# Altium schematic sheet BMS.SchDoc
size A3; ApprovedBy: Arş.Gör.Dr Şaban ULUS; CheckedBy: Arş.Gör.Dr Şaban ULUS; Engineer: Nasıf Can PELTEK; DocumentNumber: 2; Revision: -; SheetNumber: 2; SheetTotal: 2; releaseDate: 12.03.2024; changeDate: -; Department: Faculuty Of Engineering; Size: A3; projeDescription: 1S BMS PROTOYPE; fileName: BMS.SchDoc
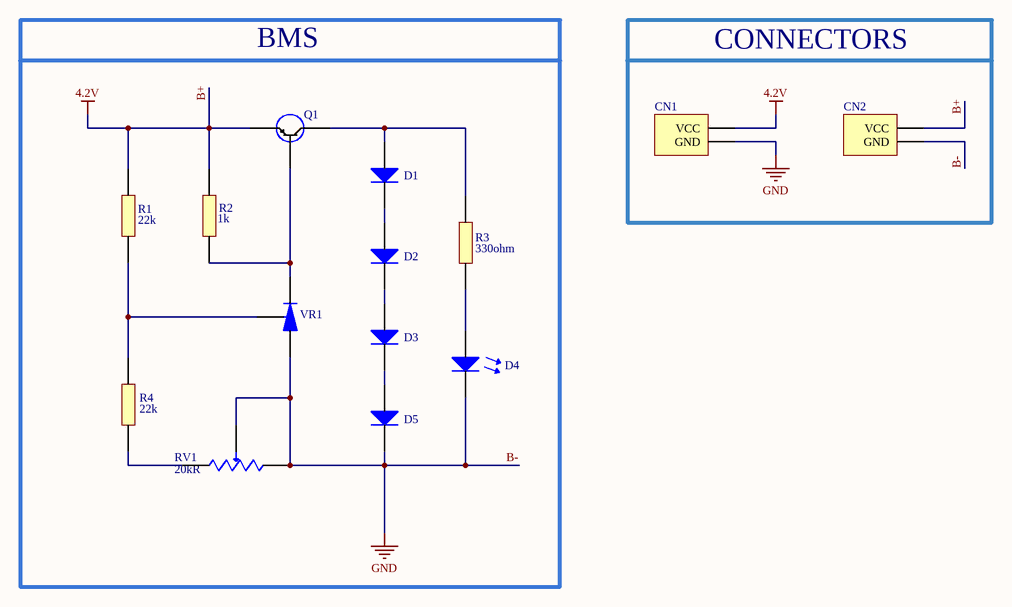
[diagram p0: BMS.SchDoc]

## Parts
CN1  TB002-500-02BE  [CONNECTOR_2PIN]  (value not drawn)
CN2  TB002-500-02BE  [CONNECTOR_2PIN]  (value not drawn)
D1  4878-1N4007TR-ND  [1N4007]  (value not drawn)
D2  4878-1N4007TR-ND  [1N4007]  (value not drawn)
D3  4878-1N4007TR-ND  [1N4007]  (value not drawn)
D4  C503B-GAN-CB0F0791  [LED]  (value not drawn)
D5  4878-1N4007TR-ND  [1N4007]  (value not drawn)
Q1  BD140OS-ND Transistör BJT TO126 - PNP 80V 1.5A  [TO126]  (value not drawn)
R1  Resistance: 22k  [RESISTOR]  (hidden comment: CF14JT22K0)
R2  Resistance: 1k  [RESISTOR]  (hidden comment: CF14JT1K00)
R3  Resistance: 330ohm  [RESISTOR]  (hidden comment: CF14JT330R)
R4  Resistance: 22k  [RESISTOR]  (hidden comment: CF14JT22K0)
RV1  Resistance: 20kR  [3296]  (hidden comment: 3296W-1-203LF)
VR1  TL431  [TO92]  (value not drawn)

## Blocks framed on the sheet
BMS: D1-D5 Q1 R1-R4 RV1 VR1
CONNECTORS: CN1 CN2

## Nets
B+: CN1.1(VCC) CN2.1(VCC) Q1.3(Emitter) R1.2 R2.2  [also labelled 4.2V]
B-: CN1.2(GND) CN2.2(GND) D4.2 D5.2 RV1.2 RV1.3 VR1.2(Anode(+))  [also labelled GND]
NetD1_1: D1.1 Q1.2(Collector) R3.2
NetD1_2: D1.2 D2.1
NetD2_2: D2.2 D3.1
NetD3_2: D3.2 D5.1
NetD4_1: D4.1 R3.1
NetQ1_1: Q1.1(Base) R2.1 VR1.1(Cathode(-))
NetR1_1: R1.1 R4.2 VR1.3(Ref)
NetR4_1: R4.1 RV1.1

## Notes on the sheet
- FILE NAME
- PREPARED BY
- DESCRIPTION
- RELEASE DATE
- DEPARTMENT
- CHECKED BY
- APPROVED BY
- SIZE
- REVISION
- CHANGE DATE
- SHEET
- /

## Library data of the parts
CN1 CN2 = CONNECTOR: 2~24 Poles, Screw Type, Horizontal, 5.0 Pitch, 22~12 (AWG), Terminal Block Connector; Manufacturer: CUI; DesignedBy: Nasıf Can Peltek; Supplier 1: Future Electronics; Manufacturer Part Number: TB002-500-02BE; RoHS: Yes; Supplier Part Number 1: 1117527
D1-D3 D5 = DIODE1N4007: Rectifier Diode, 1 Phase, 1 Element, 1A, 1000V V(RRM), Silicon, DO-41; Manufacturer: Diotec; DesignedBy: Nasıf Can Peltek; Max Surge Current: 27A; Polarity: Standard; Supplier 1: Digikey; Manufacturer Part Number: 1N4007; RoHS: Yes; Category: Rectifier Diodes; Stock 1: 7933; Pricing 1: 1=0,12, 10=0,089, 100=0,0478, 500=0,03752, 1000=0,02606, 2000=0,02159 (USD); Mount: Through Hole; Min Operating Temperature: -50°C; Max Operating Temperature: 175°C; Packaging: Ammo Pack; RoHS Compliant: Yes; ComponentLink1URL: https://datasheet.ciiva.com/26325/162272-da-01-ml-1n4007-silizium-diode-de-en-26325271.pdf?src-supplier=Conrad; ComponentLink1Description: https://datasheet.ciiva.com/26325/162272-da-01-ml-1n4007-silizium-diode-de-en-26325271.pdf?src-supplier=Conrad; ComponentLink2URL: https://datasheet.ciiva.com/48433/1n400x-eng-tds-48433165.pdf?src-supplier=Distrelec; ComponentLink2Description: https://datasheet.ciiva.com/48433/1n400x-eng-tds-48433165.pdf?src-supplier=Distrelec; Supplier Part Number 1: 4878-1N4007CT-ND
D4 = 5MM_LED_RED: Round 503-B Series Led -green Color, Full Rank, Bulk Pack; Manufacturer: Cree; DesignedBy: Nasıf Can Peltek; Supplier 1: Digikey; Manufacturer Part Number: C503B-GAN-CB0F0791; RoHS: Yes; Stock 1: 13334; Pricing 1: 1=0,29, 10=0,272, 100=0,252, 1000=0,226 (USD); ComponentLink1URL: https://datasheet.ciiva.com/26926/getdatasheetpartid-467667-26926700.pdf?src-supplier=Verical; ComponentLink1Description: https://datasheet.ciiva.com/26926/getdatasheetpartid-467667-26926700.pdf?src-supplier=Verical; ComponentLink2URL: https://datasheet.ciiva.com/8076/c503bbasbanbcsbcngasgangcsgcn1094-8076247.pdf?src-supplier=Element14; ComponentLink2Description: https://datasheet.ciiva.com/8076/c503bbasbanbcsbcngasgangcsgcn1094-8076247.pdf?src-supplier=Element14; ComponentLink3URL: https://datasheet.ciiva.com/1331/1604976-1331799.pdf?src-supplier=Newark; ComponentLink3Description: https://datasheet.ciiva.com/1331/1604976-1331799.pdf?src-supplier=Newark; ComponentLink4URL: https://datasheet.ciiva.com/2111/1300c503bbasbangasgan-2111678.pdf?src-supplier=Digikey; ComponentLink4Description: https://datasheet.ciiva.com/2111/1300c503bbasbangasgan-2111678.pdf?src-supplier=Digikey; Supplier Part Number 1: C503B-GAN-CB0F0791-ND
Q1 = BD140: 1.5 A, 80 V PNP Bipolar Power Transistor; Manufacturer: ON Semiconductor; Manufacturer Part Number: BD140G; DesignedBy: Nasıf Can Peltek; Supplier 1: Digikey; RoHS: Yes; Category: BJTs; Pricing 1: 1=0,86, 10=0,745, 100=0,5159, 500=0,43102, 1000=0,36683, 2000=0,32671, 5000=0,30951, 10000=0,28659 (USD); ComponentLink1URL: https://datasheet.ciiva.com/977/bd136-d-977150.pdf?src-supplier=Digikey; ComponentLink1Description: https://datasheet.ciiva.com/977/bd136-d-977150.pdf?src-supplier=Digikey; ComponentLink2URL: https://datasheet.ciiva.com/14169/whbd136-138-140-en-14169934.pdf?src-supplier=Distrelec; ComponentLink2Description: https://datasheet.ciiva.com/14169/whbd136-138-140-en-14169934.pdf?src-supplier=Distrelec; ComponentLink3URL: https://datasheet.ciiva.com/7971/bd136-d-7971947.pdf?src-supplier=Element14; ComponentLink3Description: https://datasheet.ciiva.com/7971/bd136-d-7971947.pdf?src-supplier=Element14; ComponentLink4URL: https://datasheet.ciiva.com/16387/bd136-d-16387067.pdf?src-supplier=Future+Electronics; ComponentLink4Description: https://datasheet.ciiva.com/16387/bd136-d-16387067.pdf?src-supplier=Future+Electronics; Supplier Part Number 1: BD140GOS-ND
R1 R4 = 22K_RESISTOR: Res Carbon Film 22K Ohm 5% 1/4W -500ppm/°C to 0ppm/°C Conformal AXL Thru-Hole T/R; Manufacturer: Stackpole Electronics; DesignedBy: Nasıf Can Peltek; Supplier 1: Digikey; Manufacturer Part Number: CF14JT22K0; RoHS: Yes; Category: Through-Hole Resistors; Stock 1: 149478; Pricing 1: 1=0,1, 10=0,053, 25=0,0404, 50=0,0308, 100=0,0215, 250=0,01728, 500=0,01382, 1000=0,01017 (USD); ComponentLink1URL: https://www.seielect.com/catalog/sei-cf_cfm.pdf?src-supplier=Digikey; ComponentLink1Description: https://www.seielect.com/catalog/sei-cf_cfm.pdf?src-supplier=Digikey; ComponentLink2URL: https://www.seielect.com/catalog/SEI-Packaging.pdf?src-supplier=Digikey; ComponentLink2Description: https://www.seielect.com/catalog/SEI-Packaging.pdf?src-supplier=Digikey; ComponentLink3URL: https://www.verical.com/server-webapp/html/getDatasheet?partID=360680&src-supplier=Verical; ComponentLink3Description: https://www.verical.com/server-webapp/html/getDatasheet?partID=360680&src-supplier=Verical; ComponentLink4URL: http://www.seielect.com/catalog/SEI-CF_CFM.pdf?src-supplier=Avnet; ComponentLink4Description: http://www.seielect.com/catalog/SEI-CF_CFM.pdf?src-supplier=Avnet; ComponentLink5URL: https://datasheet.octopart.com/CF14JT22K0-Stackpole-Electronics-datasheet-8325406.pdf?src-supplier=Future+Electronics; ComponentLink5Description: https://datasheet.octopart.com/CF14JT22K0-Stackpole-Electronics-datasheet-8325406.pdf?src-supplier=Future+Electronics; ComponentLink6URL: http://www.seielect.com/Catalog/SEI-CF_CFM.pdf?src-supplier=Future+Electronics; ComponentLink6Description: http://www.seielect.com/Catalog/SEI-CF_CFM.pdf?src-supplier=Future+Electronics; ComponentLink7URL: http://components.arrow.com/part/dataview/51859253S9848648N1174?src-supplier=Arrow+Electronics; ComponentLink7Description: http://components.arrow.com/part/dataview/51859253S9848648N1174?src-supplier=Arrow+Electronics; Supplier Part Number 1: CF14JT22K0CT-ND
R2 = 1K_RESISTOR: Res Carbon Film 1K Ohm 5% 1/4W -400ppm/°C to 0ppm/°C Conformal AXL Thru-Hole T/R; Manufacturer: Stackpole Electronics; DesignedBy: Nasıf Can Peltek; Supplier 1: Digikey; Manufacturer Part Number: CF14JT1K00; RoHS: Yes; Category: Through-Hole Resistors; Stock 1: 938854; Pricing 1: 1=0,1, 10=0,053, 25=0,0404, 50=0,0308, 100=0,0215, 250=0,01728, 500=0,01382, 1000=0,01017 (USD); ComponentLink1URL: http://components.arrow.com/part/dataview/27620077S9848643N1174?src-supplier=Arrow+Electronics; ComponentLink1Description: http://components.arrow.com/part/dataview/27620077S9848643N1174?src-supplier=Arrow+Electronics; ComponentLink2URL: https://www.seielect.com/catalog/SEI-CF_CFM.pdf?src-supplier=Avnet; ComponentLink2Description: https://www.seielect.com/catalog/SEI-CF_CFM.pdf?src-supplier=Avnet; ComponentLink3URL: https://www.seielect.com/catalog/SEI-Packaging.pdf?src-supplier=Digikey; ComponentLink3Description: https://www.seielect.com/catalog/SEI-Packaging.pdf?src-supplier=Digikey; ComponentLink4URL: https://www.seielect.com/Catalog/SEI-CF_CFM.pdf?src-supplier=Digikey; ComponentLink4Description: https://www.seielect.com/Catalog/SEI-CF_CFM.pdf?src-supplier=Digikey; ComponentLink5URL: http://www.seielect.com/Catalog/SEI-CF_CFM.pdf?src-supplier=Future+Electronics; ComponentLink5Description: http://www.seielect.com/Catalog/SEI-CF_CFM.pdf?src-supplier=Future+Electronics; ComponentLink6URL: https://www.verical.com/server-webapp/html/getDatasheet?partID=360403&src-supplier=Verical; ComponentLink6Description: https://www.verical.com/server-webapp/html/getDatasheet?partID=360403&src-supplier=Verical; ComponentLink7URL: https://datasheet.octopart.com/CF14JT1K00-Stackpole-Electronics-datasheet-8360004.pdf?src-supplier=Future+Electronics; ComponentLink7Description: https://datasheet.octopart.com/CF14JT1K00-Stackpole-Electronics-datasheet-8360004.pdf?src-supplier=Future+Electronics; ComponentLink8URL: https://datasheet.octopart.com/CF14JT1K00-Stackpole-Electronics-datasheet-32780772.pdf?src-supplier=Master+Electronics; ComponentLink8Description: https://datasheet.octopart.com/CF14JT1K00-Stackpole-Electronics-datasheet-32780772.pdf?src-supplier=Master+Electronics; Supplier Part Number 1: CF14JT1K00CT-ND
R3 = 330OHM_RESISTOR: Res Carbon Film 330 Ohm 5% 1/4W -400ppm/°C to 0ppm/°C Conformal AXL Thru-Hole T/R; Manufacturer: Stackpole Electronics; DesignedBy: Nasıf Can Peltek; Supplier 1: Digikey; Manufacturer Part Number: CF14JT330R; RoHS: Yes; Category: Through-Hole Resistors; Stock 1: 82881; Pricing 1: 1=0,1, 10=0,053, 25=0,0404, 50=0,0308, 100=0,0215, 250=0,01728, 500=0,01382, 1000=0,01017 (USD); ComponentLink1URL: https://www.seielect.com/catalog/SEI-Packaging.pdf?src-supplier=Digikey; ComponentLink1Description: https://www.seielect.com/catalog/SEI-Packaging.pdf?src-supplier=Digikey; ComponentLink2URL: https://datasheet.octopart.com/CF14JT330R-Stackpole-Electronics-datasheet-8325406.pdf?src-supplier=Future+Electronics; ComponentLink2Description: https://datasheet.octopart.com/CF14JT330R-Stackpole-Electronics-datasheet-8325406.pdf?src-supplier=Future+Electronics; ComponentLink3URL: https://www.verical.com/server-webapp/html/getDatasheet?partID=366451&src-supplier=Verical; ComponentLink3Description: https://www.verical.com/server-webapp/html/getDatasheet?partID=366451&src-supplier=Verical; ComponentLink4URL: https://www.seielect.com/catalog/SEI-CF_CFM.pdf?src-supplier=Avnet; ComponentLink4Description: https://www.seielect.com/catalog/SEI-CF_CFM.pdf?src-supplier=Avnet; ComponentLink5URL: http://www.seielect.com/Catalog/SEI-CF_CFM.pdf?src-supplier=Future+Electronics; ComponentLink5Description: http://www.seielect.com/Catalog/SEI-CF_CFM.pdf?src-supplier=Future+Electronics; ComponentLink6URL: http://components.arrow.com/part/dataview/50573461S2983167N1174?src-supplier=Arrow+Electronics; ComponentLink6Description: http://components.arrow.com/part/dataview/50573461S2983167N1174?src-supplier=Arrow+Electronics; Supplier Part Number 1: CF14JT330RCT-ND
RV1 = 20K_TRIMPOT: Cermet Not Linear TRIMMER Trimmer Potentiometer 卤10% 500mW 70C 300V; Manufacturer: Bourns; DesignedBy: Nasıf Can Peltek; Tolerance: 10%; Number of Turns: 25; Temperature Coefficient: 100ppm/°C; Supplier 1: Digikey; Manufacturer Part Number: 3296W-1-203LF; RoHS: Yes; Category: Variable Resistors and Potentiometers; Stock 1: 3603; Pricing 1: 1=2,43, 10=2,138, 25=1,9168, 50=1,8432, 100=1,7695, 250=1,6958, 500=1,40088, 1000=1,32714, 5000=1,10595 (USD); Mount: Through Hole,Panel,PCB; Weight: 0.03oz; Color: Blue; Min Operating Temperature: -55°C; Max Operating Temperature: 125°C; Power Rating: 500mW; Packaging: Rail/Tube; Termination: Pin; Taper: Linear; Resistor Type: Cermet; Max Power Dissipation: 500mW; Series: 3296; Technology: CERMET; Resistance Tolerance: 10%; Length: 9.53mm; Width: 9.53mm; Height: 10.03mm; Depth: 4.83mm; Radiation Hardening: No; Reach SVHC Compliant: No; Military Standard: Not; Lead Free: Lead Free; RoHS Compliant: Yes; ComponentLink1URL: https://datasheet.ciiva.com/14173/ew3296-dat-e-14173023.pdf?src-supplier=Distrelec; ComponentLink1Description: https://datasheet.ciiva.com/14173/ew3296-dat-e-14173023.pdf?src-supplier=Distrelec; ComponentLink2URL: https://datasheet.ciiva.com/15156/getdatasheetpartid-62506-15156343.pdf?src-supplier=Verical; ComponentLink2Description: https://datasheet.ciiva.com/15156/getdatasheetpartid-62506-15156343.pdf?src-supplier=Verical; Supplier Part Number 1: 3296W-203LF-ND
VR1 = TL431: V-Ref Adjustable 2.495V to 36V 100mA 3-Pin TO-92 Ammo; Manufacturer: STMicroelectronics; Manufacturer Part Number: TL431CZ-AP; Max Input Voltage: 37V; Reference Type: Shunt,Adjustable; Number of Channels: 1; Tolerance: 2.21%; Cathode Current: 1mA; Accuracy: 2%; Temperature Coefficient: 100ppm/°C; Output Impedance: 500mR; DesignedBy: Nasıf Can PELTEK; Supplier 1: Digikey; RoHS: Yes; Category: Voltage References; Stock 1: 8253; Pricing 1: 1=0,46, 10=0,373, 25=0,3408, 100=0,2537, 250=0,22992, 500=0,19028, 1000=0,14271 (USD); Mount: Through Hole; Case/Package: TO-92; Min Operating Temperature: 0°C; Max Operating Temperature: 70°C; Output Voltage: 36V; Max Output Current: 100mA; Package Quantity: 2000; Packaging: Cut Tape; Min Output Voltage: 2.495V; Max Output Voltage: 36V; Output Current: 100mA; Reference Voltage: 2.495V; Output Type: Adjustable; Series: -; Supply Current: 100mA; Lead Free: Lead Free; RoHS Compliant: Yes; ComponentLink1URL: https://datasheet.ciiva.com/4909/cd00000986-4909435.pdf?src-supplier=Mouser; ComponentLink1Description: https://datasheet.ciiva.com/4909/cd00000986-4909435.pdf?src-supplier=Mouser; ComponentLink2URL: https://datasheet.ciiva.com/2011/cd00000986-2011433.pdf?src-supplier=Digikey; ComponentLink2Description: https://datasheet.ciiva.com/2011/cd00000986-2011433.pdf?src-supplier=Digikey; Supplier Part Number 1: 497-15786-1-ND